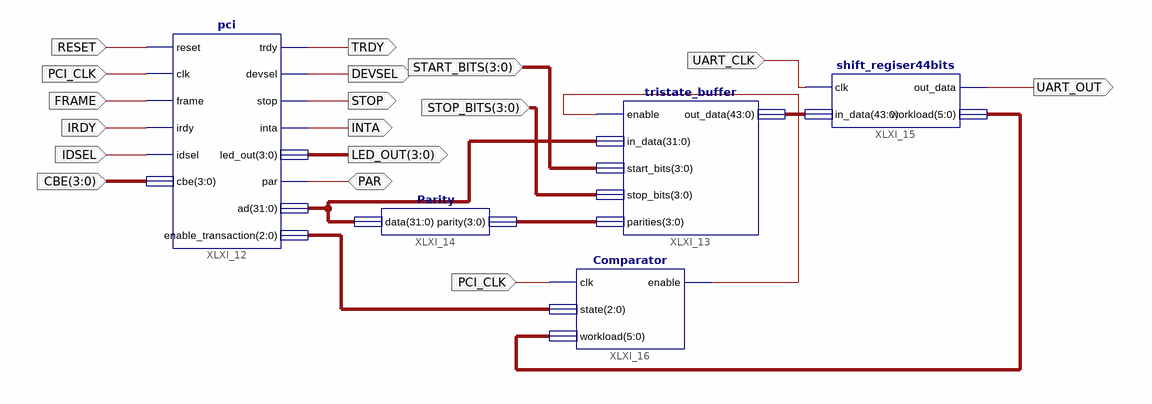
[diagram p0: schematic sheet 1]
// Xilinx ISE schematic e3.sch (spartan6) as structural Verilog: 5 symbols, 16 ports
module e3 (
  input  RESET,
  input  PCI_CLK,
  input  FRAME,
  input  IRDY,
  input  IDSEL,
  input  [3:0] CBE,
  input  UART_CLK,
  input  [3:0] STOP_BITS,
  input  [3:0] START_BITS,
  inout  PAR,
  output TRDY,
  output DEVSEL,
  output STOP,
  output INTA,
  output [3:0] LED_OUT,
  output UART_OUT
);

  wire XLXN_44;
  wire [2:0] XLXN_2;
  wire [3:0] XLXN_5;
  wire [5:0] XLXN_7;
  wire [31:0] XLXN_1;
  wire [43:0] XLXN_4;

  pci XLXI_12 (
    .reset(RESET), .clk(PCI_CLK), .frame(FRAME), .irdy(IRDY), .idsel(IDSEL), .cbe(CBE), .par(PAR),
    .ad(XLXN_1), .trdy(TRDY), .devsel(DEVSEL), .stop(STOP), .inta(INTA), .led_out(LED_OUT),
    .enable_transaction(XLXN_2));
  tristate_buffer XLXI_13 (
    .enable(XLXN_44), .in_data(XLXN_1), .start_bits(START_BITS), .stop_bits(STOP_BITS), .parities(XLXN_5),
    .out_data(XLXN_4));
  Parity XLXI_14 (.data(XLXN_1), .parity(XLXN_5));
  shift_regiser44bits XLXI_15 (.clk(UART_CLK), .in_data(XLXN_4), .out_data(UART_OUT), .workload(XLXN_7));
  Comparator XLXI_16 (.clk(PCI_CLK), .state(XLXN_2), .workload(XLXN_7), .enable(XLXN_44));
endmodule
